# EAGLE design modbus_rtu_io (EAGLE 6.4)
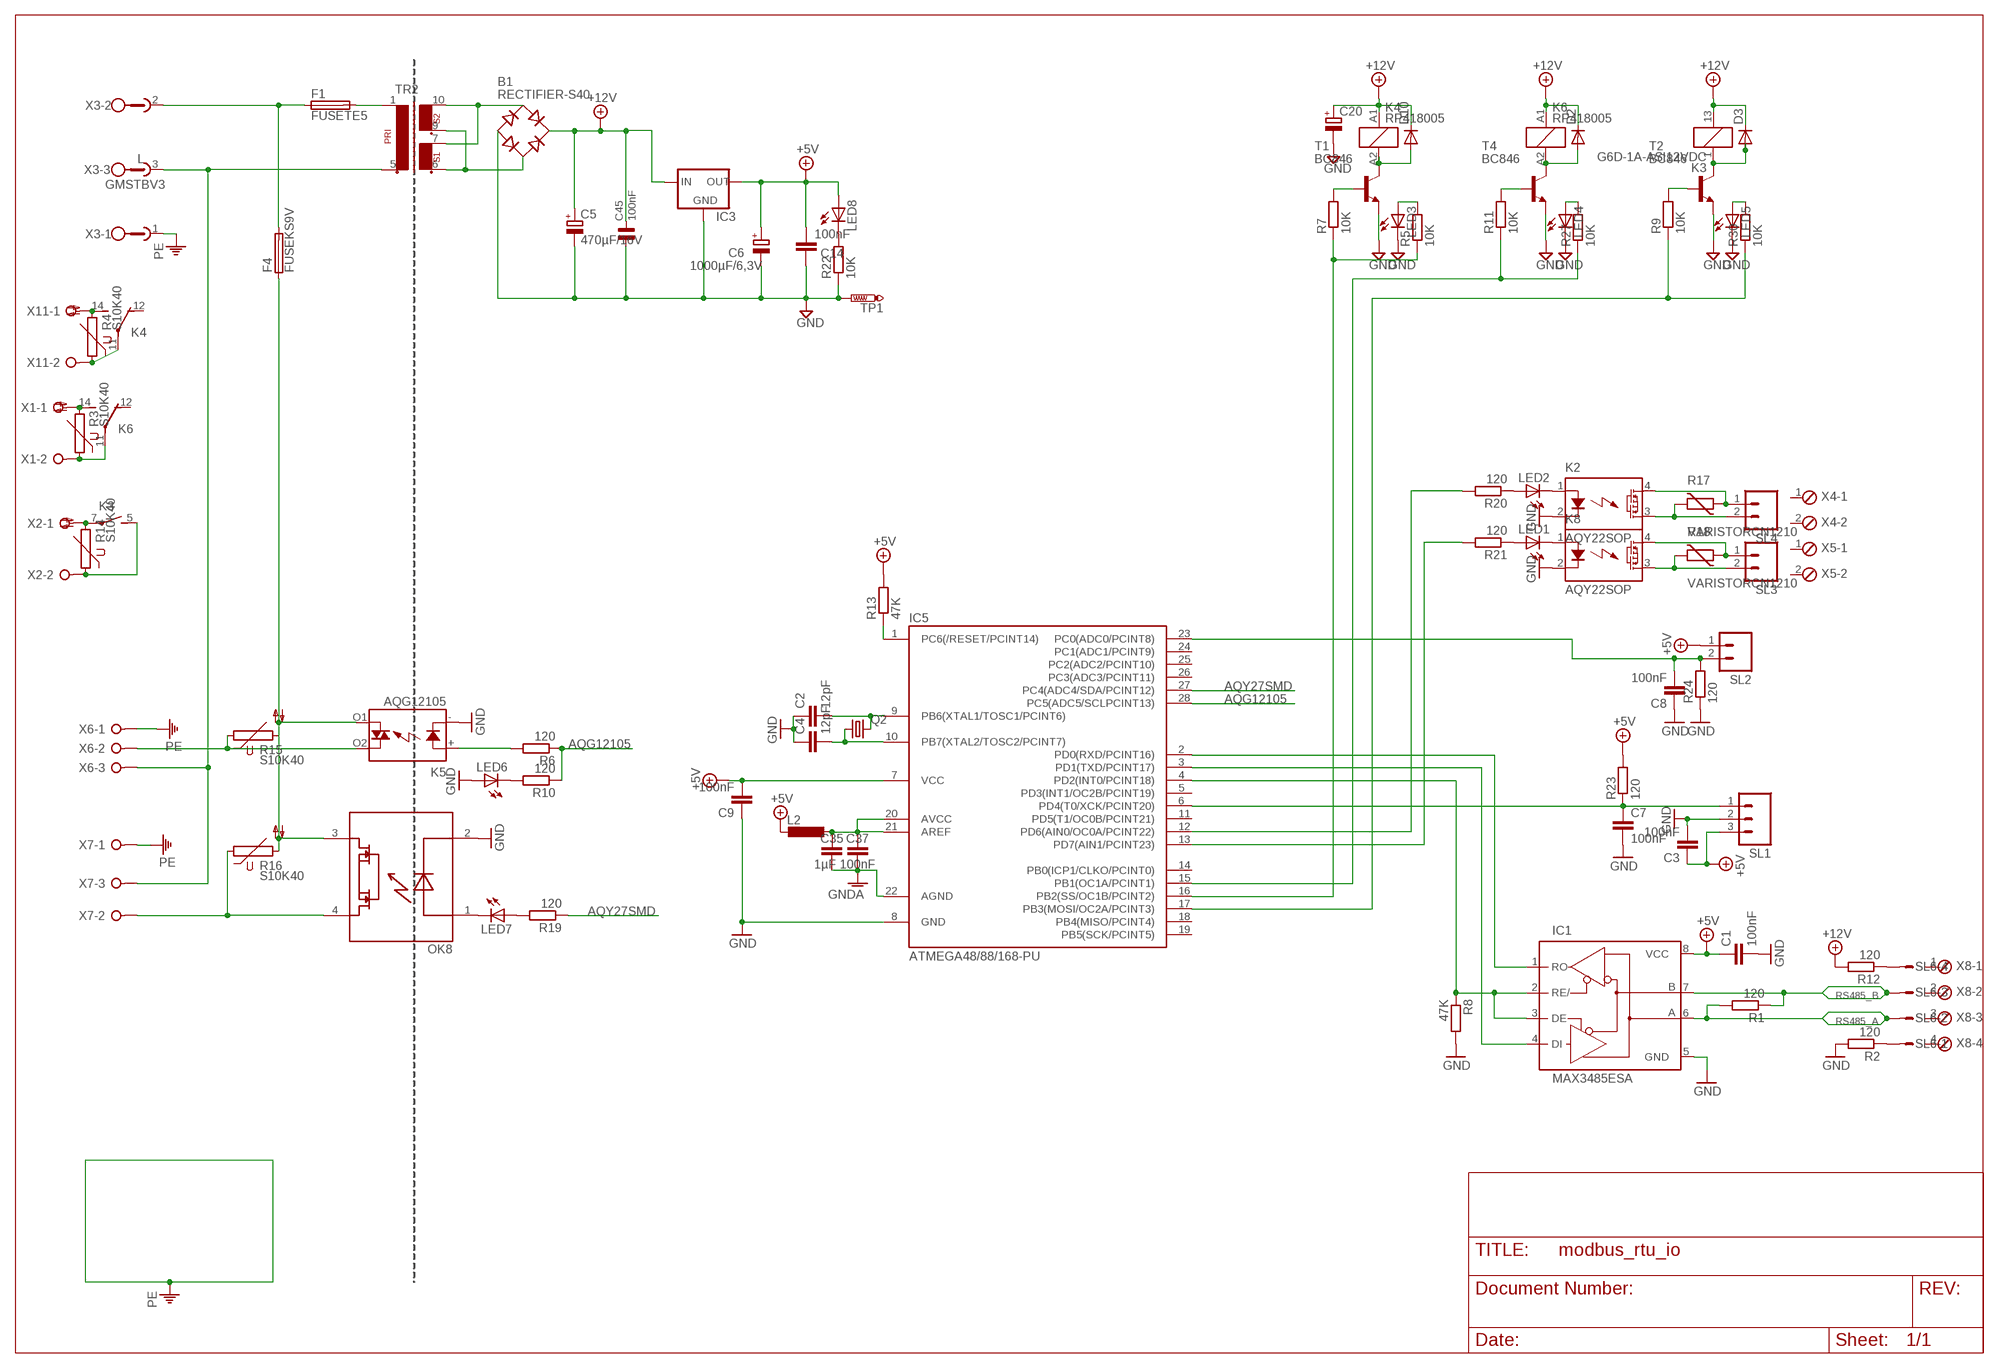
[diagram p0: schematic, sheet 1]

## Parts
B1  RECTIFIER-S40  [TO-269AA]
C1  100nF  C-EUC0603  [C0603]
C2  12pF  C-EUC0805  [C0805]
C3  100nF  C-EUC0603  [C0603]
C4  12pF  C-EUC0805  [C0805]
C5  470µF/16V  CPOL-EUE3.5-8  [E3,5-8]
C6  1000µF/6,3V  CPOL-EUE3.5-8  [E3,5-8]
C7  100nF  C-EUC0603  [C0603]
C8  100nF  C-EUC0603  [C0603]
C9  100nF  C-EUC0603  [C0603]
C14  100nF  C-EUC1206  [C1206]
C20  CPOL-EUE3.5-8  [E3,5-8]
C35  1µF  C-EUC0603  [C0603]
C37  100nF  C-EUC0603  [C0603]
C45  100nF  C0805  [C0805]
D2  DIODE-MINIMELF  [MINIMELF]
D3  DIODE-MINIMELF  [MINIMELF]
D10  DIODE-MINIMELF  [MINIMELF]
F1  FUSETE5  [TE5]
F4  FUSEKS9V  [KS9V]
IC1  MAX3485ESA  MAX3469ESA  [SO08]
IC3  78XXS  [78XXS]
IC5  ATMEGA48/88/168-PU  [DIL28-3]
K2  AQY22SOP  [SOP04]
K3  G6D-1A-ASI12VDC  [G6D]
K4  RP418005  [RT-C/O12A3.5]
K5  AQG12105  [AQG]
K6  RP418005  [RT-C/O12A3.5]
K8  AQY22SOP  [SOP04]
L2  L-EUL0805  [L0805]
LED1  LED3MM  [LED3MM]
LED2  LED3MM  [LED3MM]
LED3  LED3MM  [LED3MM]
LED4  LED3MM  [LED3MM]
LED5  LED3MM  [LED3MM]
LED6  LED3MM  [LED3MM]
LED7  LED3MM  [LED3MM]
LED8  LED3MM  [LED3MM]
OK8  AQY280  [DIL4-SMD]
Q2  CRYTALHC49S  [HC49/S]
R1  120  R-EU_R0603  [R0603]
R2  120  R-EU_R0603  [R0603]
R3  S10K40  [S10K40]
R4  S10K40  [S10K40]
R5  10K  R-EU_R0603  [R0603]
R6  120  R-EU_R0603  [R0603]
R7  10K  R-EU_R0603  [R0603]
R8  47K  R-EU_R0603  [R0603]
R9  10K  R-EU_R0603  [R0603]
R10  120  R-EU_R0603  [R0603]
R11  10K  R-EU_R0603  [R0603]
R12  120  R-EU_R0603  [R0603]
R13  47K  R-EU_R0603  [R0603]
R14  S10K40  [S10K40]
R15  S10K40  [S10K40]
R16  S10K40  [S10K40]
R17  VARISTORCN1210  [CT/CN1210]
R18  VARISTORCN1210  [CT/CN1210]
R19  120  R-EU_R0603  [R0603]
R20  120  R-EU_R0603  [R0603]
R21  120  R-EU_R0603  [R0603]
R22  10K  R-EU_R0603  [R0603]
R23  120  R-EU_R0603  [R0603]
R24  120  R-EU_R0603  [R0603]
R27  10K  R-EU_R0603  [R0603]
R30  10K  R-EU_R0603  [R0603]
SL1  M03  [03P]
SL2  M02  [02P]
SL3  M02  [02P]
SL4  M02  [02P]
SL6  M04S  [04P]
T1  BC846  [SOT23]
T2  BC846  [SOT23]
T4  BC846  [SOT23]
TP1  PTR1PAD1-13  [P1-13]
TR2  EI30-2  [EI30-2]
X1  W237-02P  [W237-132]
X2  W237-02P  [W237-132]
X3  GMSTBV3  [GMSTBV3]
X4  MPT2  [2POL254]
X5  MPT2  [2POL254]
X6  W237-03P  [W237-133]
X7  W237-03P  [W237-133]
X8  MPT4  [4POL254]
X11  W237-02P  [W237-132]

## Nets
+5V: C1.1 C3.1 C6.+ C9.2 C14.2 IC1.8(VCC) IC3.OUT IC5.7(VCC) L2.2 LED8.A R13.2 R23.2 SL1.3 SL2.1
+12V: B1.+ C5.+ C20.+ C45.2 D2.C D3.C D10.C IC3.IN K3.13 K4.A1 K6.A1 R12.2
AQG12105: IC5.28(PC5(ADC5/SCLPCINT13)) R6.1 R10.1
AQY27SMD: IC5.27(PC4(ADC4/SDA/PCINT12)) R19.1
AVCC: C35.1 C37.1 IC5.20(AVCC) IC5.21(AREF) L2.1
GND: B1.- C1.2 C2.1 C3.2 C4.1 C5.- C6.- C7.2 C8.1 C9.1 C14.1 C20.- C45.1 IC1.5(GND) IC3.GND IC5.8(GND) K2.2(K) K5.-(K) K8.2(K) LED3.K(C) LED4.K(C) LED5.K(C) LED6.A OK8.2 R2.2 R8.2 R22.1 R24.1 SL1.2 T1.2(E) T2.2(E) T4.2(E) TP1.TP
GNDA: C35.2 C37.2 IC5.22(AGND)
L: F1.1 F4.2 X3.2
N$1: C2.2 IC5.9(PB6(XTAL1/TOSC1/PCINT6)) Q2.2
N$2: R9.2 T2.1(B)
N$3: LED3.A R5.2
N$4: K4.11(2:P) R4.1 X11.2
N$5: K4.14(2:S) R4.2 X11.1
N$6: K6.14(2:S) R3.2 X1.1
N$7: R7.2 T1.1(B)
N$8: R2.1 SL6.1
N$9: IC1.1(RO) IC5.2(PD0(RXD/PCINT16))
N$10: IC1.4(DI) IC5.3(PD1(TXD/PCINT17))
N$11: D10.A K4.A2 T1.3(C)
N$12: D3.A K3.1 T2.3(C)
N$13: R11.2 T4.1(B)
N$14: D2.A K6.A2 T4.3(C)
N$15: IC1.2(RE/) IC1.3(DE) IC5.4(PD2(INT0/PCINT18)) R8.1
N$16: K8.4(DS1) R18.1 SL3.1
N$17: C4.2 IC5.10(PB7(XTAL2/TOSC2/PCINT7)) Q2.1
N$18: K8.3(DS2) R18.2 SL3.2
N$19: B1.AC1 TR2.7 TR2.10
N$20: K2.4(DS1) R17.1 SL4.1
N$21: K2.3(DS2) R17.2 SL4.2
N$22: B1.AC2 TR2.6 TR2.9
N$23: F1.2 TR2.1
N$24: K6.11(2:P) R3.1 X1.2
N$25: K3.7(2:P) R14.2 X2.1
N$26: K3.5(2:S) R14.1 X2.2
N$27: K5.O2(DS1) R15.1 X6.2
N$28: TR2.5 X3.3 X6.3 X7.3
N$29: OK8.4 R16.1 X7.2
N$30: K5.+(A) R6.2
N$31: LED7.K(C) OK8.1
N$32: K2.1(A) LED2.K(C)
N$33: F4.1 K5.O1(DS2) OK8.3 R15.2 R16.2
N$34: LED4.A R27.2
N$35: K8.1(A) LED1.K(C)
N$36: IC5.16(PB2(SS/OC1B/PCINT2)) R5.1 R7.1
N$37: IC5.12(PD6(AIN0/OC0A/PCINT22)) R20.2
N$38: IC5.13(PD7(AIN1/PCINT23)) R21.2
N$39: IC5.15(PB1(OC1A/PCINT1)) R11.1 R27.1
N$40: IC5.17(PB3(MOSI/OC2A/PCINT3)) R9.1 R30.1
N$41: LED1.A R21.1
N$42: LED2.A R20.1
N$43: LED7.A R19.2
N$44: LED6.K(C) R10.2
N$45: R12.1 SL6.4
N$50: LED5.A R30.2
N$51: LED8.K(C) R22.2
N$53: C7.1 IC5.6(PD4(T0/XCK/PCINT20)) R23.1 SL1.1
N$55: IC5.1(PC6(/RESET/PCINT14)) R13.1
N$56: C8.2 IC5.23(PC0(ADC0/PCINT8)) R24.2 SL2.2
PE: X3.1 X6.1 X7.1
RS485_A: IC1.6(A) R1.2 SL6.2
RS485_B: IC1.7(B) R1.1 SL6.3
Unconnected: IC5.5(PD3(INT1/OC2B/PCINT19)) IC5.11(PD5(T1/OC0B/PCINT21)) IC5.14(PB0(ICP1/CLKO/PCINT0)) IC5.18(PB4(MISO/PCINT4)) IC5.19(PB5(SCK/PCINT5)) IC5.24(PC1(ADC1/PCINT9)) IC5.25(PC2(ADC2/PCINT10)) IC5.26(PC3(ADC3/PCINT11)) K4.12(2:O) K6.12(2:O) X4.1 X4.2 X5.1 X5.2 X8.1 X8.2 X8.3 X8.4

## Library data of the parts
B1 = rectifier:RECTIFIER-: Rectifier
C1-C4 C7-C9 C14 = rcl:C-EU: CAPACITOR, European symbol
C5 C6 C20 = rcl:CPOL-EU: POLARIZED CAPACITOR, European symbol
C35 C37 = rcl-2:C-EU: CAPACITOR, European symbol
C45 = SMD-Sort2:C0805
D2 D3 D10 = diode-1:DIODE-: DIODE
F1 F4 = fuse:FUSE: Fuse
IC1 = maxim:MAX34*: +5V, Fail-Safe, 40Mbps, Profibus RS-485/RS-422 Transceivers Source: MAX3465-MAX3469.pdf
IC3 = v-reg:78XXS: VOLTAGE REGULATOR
IC5 = atmega8:ATMEGA48/88/168-PU
K2 K8 = relay:AQY*: PhotoMOS Relay NAiS Source: http://www.panasonic-electric-works.com/catalogues/downloads/photomos/ds_x615_en_aqz10_20.pdf; OC_FARNELL: unknown; OC_NEWARK: unknown
K3 = relay:G6D?*: OMRON Slim, Miniature PCB Relay 17.5 × 6.5 × 12.5 mm with Socked Source: http://ecb.omron.com.sg/pdf/relay/power/G6D.pdf; OC_FARNELL: unknown; OC_NEWARK: unknown
K4 K6 = relay:RP?18*: Power PCB Relay RP II/1 SCHRACK 1 pole 8 / 12 A Source: http://www.schrack.com/.. 5834.pdf; OC_FARNELL: unknown; OC_NEWARK: unknown
K5 = relay:AQG*: SOLID STATE RELAY NAiS Zero-cross, Non zero-cross Source: http://www.mew-europe.com/.. en_ds_61611_0000.pdf; MF: AROMAT/ MATSUSHITA; MPN: AQG12105; OC_FARNELL: unknown; OC_NEWARK: 20J4759
L2 = rcl:L-EU: INDUCTOR, European symbol
LED1-LED8 = led:LED: LED OSRAM: - CHIPLED LG R971, LG N971, LY N971, LG Q971, LY Q971, LO R971, LY R971 LH N974, LH R974 LS Q976, LO Q976, LY Q976 LO Q996 - Hyper CHIPLED LW Q18S LB Q993, LB Q99A, LB R99A - SideLED LS A670, LO A670, LY A670, LG A670, LP A670 LB A673, LV A673, LT A673, LW A673 LH A674 LY A675 LS A676, LA A676, LO A676, LY A676, LW A676 LS A679, LY A679, LG A679 - Hyper Micro SIDELED® LS Y876, LA Y876, LO Y876, LY Y876 LT Y87S - SmartLED LW L88C, LW L88S LB L89C, LB L89S, LG L890 LS L89K, LO L89K, LY L89K LS L896, LA L896, LO L896, LY L896 - TOPLED LS T670, LO T670, LY T670, LG T670, LP T670 LSG T670, LSP T670, LSY T670, LOP T670, LYG T670 LG T671, LOG T671, LSG T671 LB T673, LV T673, LT T673, LW T673 LH T674 LS T676, LA T676, LO T676, LY T676, LB T676, LH T676, LSB T676, LW T676 LB T67C, LV T67C, LT T67C, LS T67K, LO T67K, LY T67K, LW E67C LS E67B, LA E67B, LO E67B, LY E67B, LB E67C, LV E67C, LT E67C LW T67C LS T679, LY T679, LG T679 LS T770, LO T770, LY T770, LG T770, LP T770 LB T773, LV T773, LT T773, LW T773 LH T774 LS E675, LA E675, LY E675, LS T675 LS T776, LA T776, LO T776, LY T776, LB T776 LHGB T686 LT T68C, LB T68C - Hyper Mini TOPLED® LB M676 - Mini TOPLED Santana® LG M470 LS M47K, LO M47K, LY M47K Source: http://www.osram.convergy.de LUXEON: - LUMILED® LXK2-PW12-R00, LXK2-PW12-S00, LXK2-PW14-U00, LXK2-PW14-V00 LXK2-PM12-R00, LXK2-PM12-S00, LXK2-PM14-U00 LXK2-PE12-Q00, LXK2-PE12-R00, LXK2-PE12-S00, LXK2-PE14-T00, LXK2-PE14-U00 LXK2-PB12-K00, LXK2-PB12-L00, LXK2-PB12-M00, LXK2-PB14-N00, LXK2-PB14-P00, LXK2-PB14-Q00 LXK2-PR12-L00, LXK2-PR12-M00, LXK2-PR14-Q00, LXK2-PR14-R00 LXK2-PD12-Q00, LXK2-PD12-R00, LXK2-PD12-S00 LXK2-PH12-R00, LXK2-PH12-S00 LXK2-PL12-P00, LXK2-PL12-Q00, LXK2-PL12-R00 Source: www.luxeon.com KINGBRIGHT: KA-3528ASYC Source: www.kingbright.com
OK8 = optocoupler:AQY280
Q2 = crystal:CRYTAL: CRYSTAL
R1 R2 R5-R13 R19-R24 R27 R30 = rcl:R-EU_: RESISTOR, European symbol
R3 R4 R14-R16 = varistor:S10K40: VARISTOR
R17 R18 = varistor:VARISTOR: VARISTOR
SL1 = con-amp-quick:M03: AMP QUICK CONNECTOR; OC_FARNELL: unknown; OC_NEWARK: unknown
SL2-SL4 = con-amp-quick:M02: AMP QUICK CONNECTOR; OC_FARNELL: unknown; OC_NEWARK: unknown
SL6 = con-amp-quick:M04S: AMP QUICK CONNECTOR; OC_FARNELL: unknown; OC_NEWARK: unknown
T1 T2 T4 = transistor:BC846: NPN TRANSISTOR
TP1 = testpad:PTR1: TEST PIN
TR2 = trafo:EI30-2: TRANSFORMER 1 primary winding, 2 secondary windings ERA
X1 X2 X11 = con-wago-508:W237-02P: WAGO SREW CLAMP; OC_FARNELL: unknown; OC_NEWARK: unknown
X3 = con-phoenix-762:GMSTBV3: PHOENIX; MPN: GMSTBVA2,5/3-G-7,62; OC_FARNELL: 1793080; OC_NEWARK: 69R9521
X4 X5 = con-phoenix-254:MPT2: PHOENIX CONNECTOR; OC_FARNELL: unknown; OC_NEWARK: unknown
X6 X7 = con-wago-508:W237-03P: WAGO SREW CLAMP; OC_FARNELL: unknown; OC_NEWARK: unknown
X8 = con-phoenix-254:MPT4: PHOENIX CONNECTOR; OC_FARNELL: unknown; OC_NEWARK: unknown

## Board
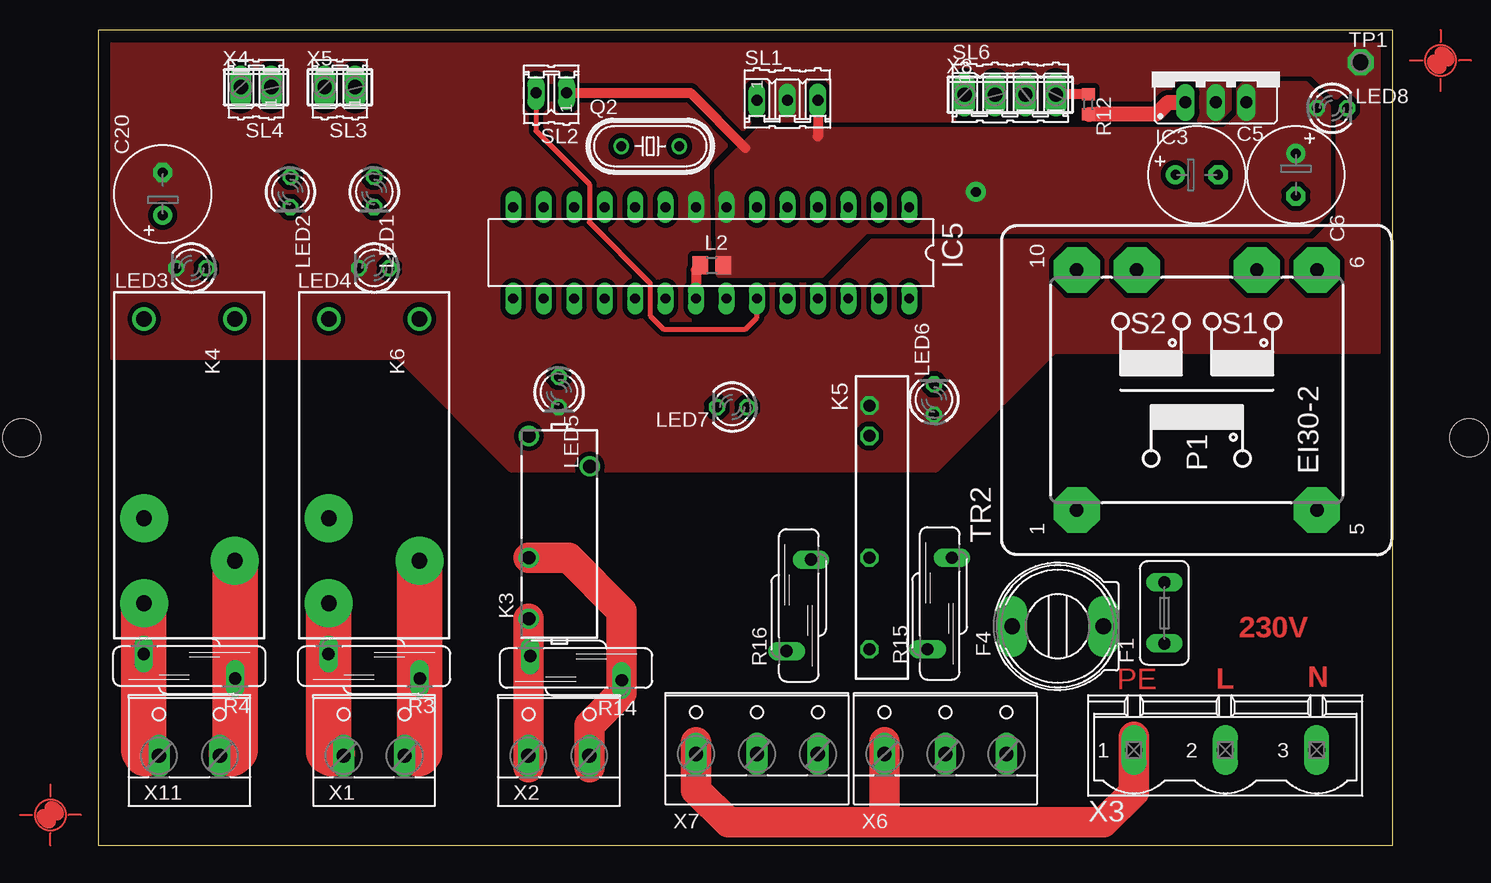
[diagram p1: board, top side]
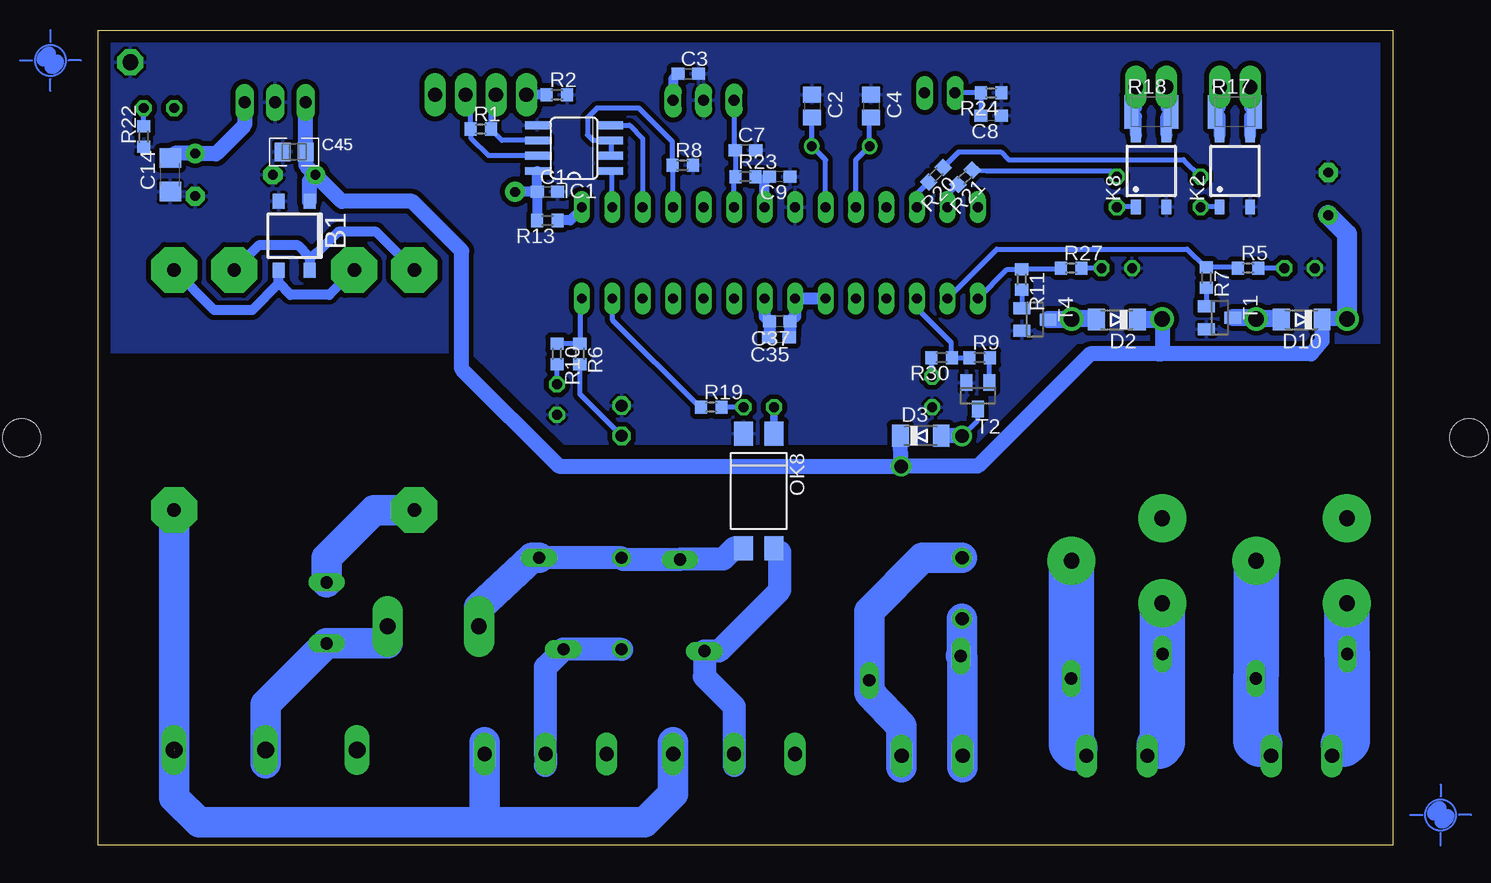
[diagram p2: board, bottom side, seen from below]

Size 107.95 x 67.94 mm. Coordinates in mm from the lower left corner, seen from the top.
Outline: 0,0 107.95,0 107.95,67.94 0,67.94 0,0
Copper layers (1*16): Top 0.035mm / dielectric 1.5mm / Bottom 0.035mm
Design rules "default": minimum track width 10mil, minimum drill 24mil, track to track 8mil, track to pad 8mil, pad to pad 8mil, via to via 8mil, smd to smd 8mil, copper to edge 40mil, drill to drill 8mil, minimum pad ring 10mil, minimum via ring 8mil, stop-mask expansion 4mil, vias tented up to drill 0mil, thermal gap 10mil
Holes 3.17 mm at -6.35,33.97 114.3,33.97
Milling: area 0,0 to 108,67.9

### Footprints (pad centres in the part's own frame; a part is rotated, then mirrored left to right if it is on the bottom)
TO-269AA = smd 1 x 1.25: + -1.28,-2.855; - 1.28,-2.855; AC1 -1.28,2.855; AC2 1.28,2.855
C0603 = smd 1.1 x 1: 1 -0.85,0; 2 0.85,0
C0805 = smd 1.3 x 1.5: 1 -0.95,0; 2 0.95,0
E3,5-8 = drill 0.813 pad 1.6: + -1.778,0 | drill 0.813 pad 1.6 octagon: - 1.778,0
C1206 = smd 1.6 x 1.8: 1 -1.4,0; 2 1.4,0
C0805' = smd 1.321 x 1.524: 1 -0.965,0; 2 0.965,0
MINIMELF = smd 1.4 x 1.8: A 1.7,0; C -1.7,0
TE5 = drill 1.016 long: 1 -2.54,0; 2 2.54,0
KS9V = drill 1.321 pad 2.54 long: 1 0,3.81; 2 0,-3.81
SO08 = smd 0.66 x 2.032: 1 -1.905,-3.073; 2 -0.635,-3.073; 3 0.635,-3.073; 4 1.905,-3.073; 5 1.905,3.073; 6 0.635,3.073; 7 -0.635,3.073; 8 -1.905,3.073
78XXS = drill 1.016 long: GND 0,-2.54; IN -2.54,-2.54; OUT 2.54,-2.54
DIL28-3 = drill 0.813 long: 1 -16.51,-3.81; 2 -13.97,-3.81; 3 -11.43,-3.81; 4 -8.89,-3.81; 5 -6.35,-3.81; 6 -3.81,-3.81; 7 -1.27,-3.81; 8 1.27,-3.81; 9 3.81,-3.81; 10 6.35,-3.81; 11 8.89,-3.81; 12 11.43,-3.81; 13 13.97,-3.81; 14 16.51,-3.81; 15 16.51,3.81; 16 13.97,3.81; 17 11.43,3.81; 18 8.89,3.81; 19 6.35,3.81; 20 3.81,3.81; 21 1.27,3.81; 22 -1.27,3.81; 23 -3.81,3.81; 24 -6.35,3.81; 25 -8.89,3.81; 26 -11.43,3.81; 27 -13.97,3.81; 28 -16.51,3.81
SOP04 = smd 0.8 x 1.2: 1 -1.27,-3; 2 1.27,-3; 3 1.27,3; 4 -1.27,3
G6D = drill 1.1 pad 1.676: 1 8.08,2.5; 5 -2.08,2.5; 7 -7.16,2.5; 13 5.54,-2.58
RT-C/O12A3.5 = drill 1.3 pad 4: 11 7.56,3.78; 12 4.02,-3.78; 14 11.1,-3.78 | drill 1.3: A1 -12.6,-3.78; A2 -12.6,3.78
AQG = drill 1 octagon: + -7.62,0; - -10.16,0; O1 2.54,0; O2 10.16,0
L0805 = smd 1.3 x 1.5: 1 -0.95,0; 2 0.95,0
LED3MM = drill 0.813 octagon: A -1.27,0; K 1.27,0
DIL4-SMD = smd 1.6 x 2: 1 -1.27,-4.77; 2 1.27,-4.77; 3 1.27,4.77; 4 -1.27,4.77
HC49/S = drill 0.813: 1 -2.413,0; 2 2.413,0
R0603 = smd 1 x 1.1: 1 -0.85,0; 2 0.85,0
S10K40 = drill 1.016 long: 1 -1.016,-3.81; 2 1.016,3.81
CT/CN1210 = smd 1.2 x 2.8: 1 -1.65,0; 2 1.65,0
03P = drill 0.914 long: 1 -2.54,0; 2 0,0; 3 2.54,0
02P = drill 0.914 long: 1 -1.27,0; 2 1.27,0
04P = drill 0.914 long: 1 -3.81,0; 2 -1.27,0; 3 1.27,0; 4 3.81,0
SOT23 = smd 1 x 1.4: 1 -0.95,-1.1; 2 0.95,-1.1; 3 0,1.1
P1-13 = drill 1.321 pad 2.159 octagon: TP 0,0
EI30-2 = drill 1.118 pad 3.81 octagon: 1 -10.008,10.008; 5 -10.008,-10.008; 6 10.008,-10.008; 7 10.008,-5.004; 9 10.008,5.004; 10 10.008,10.008
W237-132 = drill 1.194 long: 1 -2.54,-0.635; 2 2.54,-0.635
GMSTBV3 = drill 1.397 long: 1 -7.62,0; 2 0,0; 3 7.62,0
2POL254 = drill 1.2 long: 1 -1.27,0; 2 1.27,0
W237-133 = drill 1.194 long: 1 -5.08,-0.635; 2 0,-0.635; 3 5.08,-0.635
4POL254 = drill 1.2 long: 1 -3.81,0; 2 -1.27,0; 3 1.27,0; 4 3.81,0

### Placement (x,y rotation side)
B1  91.6,50.8 180 bottom
C1  70.48,54.45 0 bottom
C2  48.42,61.59 270 bottom
C3  58.74,64.29 0 bottom
C4  43.5,61.59 270 bottom
C5  91.6,55.88 0 top
C6  99.85,55.88 270 top
C7  53.98,57.94 0 bottom
C8  33.5,60.8 180 bottom
C9  51.12,55.72 180 bottom
C14  101.92,55.88 90 bottom
C20  5.4,54.29 90 top
C35  51.18,42.32 180 bottom
C37  51.12,43.66 180 bottom
C45  100nF  [C0805']  91.6,57.78 0 bottom
D2  23.02,43.82 180 bottom
D3  39.37,34.13 0 bottom
D10  7.62,43.81 180 bottom
F1  88.9,19.37 90 top
F4  80.01,18.26 90 top
IC1  68.26,58.1 90 bottom
IC3  93.19,64.45 0 top
IC5  51.12,49.37 180 top
K2  13.18,56.2 0 bottom
K3  38.42,26.04 90 top
K4  7.62,31.27 270 top
K5  64.3,26.49 270 top
K6  23.02,31.27 270 top
K8  20.16,56.2 0 bottom
L2  51.16,48.35 0 top
LED1  23.02,54.45 270 top
LED2  16.03,54.45 270 top
LED3  7.78,48.1 180 top
LED4  23.02,48.1 180 top
LED5  38.42,37.78 270 top
LED6  69.69,37.15 90 top
LED7  52.86,36.51 180 top
LED8  102.87,61.44 0 top
OK8  52.86,29.53 180 bottom
Q2  46.04,58.26 0 top
R1  76.04,59.69 0 bottom
R2  69.69,62.55 0 bottom
R3  23.02,14.92 90 top
R4  7.62,14.92 90 top
R5  12.06,48.1 0 bottom
R6  67.79,40.96 270 bottom
R7  15.56,47.31 270 bottom
R8  59.21,56.67 0 bottom
R9  34.45,40.64 0 bottom
R10  69.69,40.96 270 bottom
R11  30.96,47.15 270 bottom
R12  82.55,61.75 270 top
R13  70.48,52.07 180 bottom
R14  39.85,14.76 90 top
R15  70.17,20.16 0 top
R16  58.42,20 0 top
R17  13.18,61.12 0 bottom
R18  20.16,61.12 0 bottom
R19  56.83,36.51 0 bottom
R20  38.1,55.88 225 bottom
R21  35.67,55.67 225 bottom
R22  104.14,59.05 90 bottom
R23  53.98,55.72 0 bottom
R24  33.5,62.71 180 bottom
R27  26.83,48.1 0 bottom
R30  37.62,40.64 180 bottom
SL1  57.47,62.07 0 top
SL2  37.78,62.71 180 top
SL3  20.16,63.18 180 top
SL4  13.18,63.18 180 top
SL6  76.04,62.55 0 top
T1  14.45,43.97 270 bottom
T2  34.61,37.46 180 bottom
T4  29.85,43.81 270 bottom
TP1  105.25,65.25 0 top
TR2  91.6,37.94 90 top
U$1  [PASS-ROUND]  111.92,65.41 0 top  (outside the outline)
U$2  [PASS-ROUND]  -3.97,2.54 0 top  (outside the outline)
X1  23.02,8.1 0 top
X2  38.42,8.1 0 top
X3  93.98,7.94 0 top
X4  13.18,63.18 0 top
X5  20.16,63.18 0 top
X6  70.64,8.26 0 top
X7  54.93,8.26 0 top
X8  76.04,62.55 0 top
X11  7.62,8.1 0 top

### Tracks (layer width: path | path; a pad name or v marks a point on that pad's centre or on a via)
+5V  (via drill 0.8 pad 1.68)
  Top 0.813: SL1.3 60.01,59.05 | SL2.1 49.37,62.71 53.98,58.1
  Bottom 0.406: R23.2 C9.2
  Bottom 0.813: IC5.7 52.39,55.3 C9.2 | C1.1 v73.18,54.45 | C1.1 IC1.8 | C1.1 R13.2 | C3.1 60.01,63.87 SL1.3
  Bottom 1.27: IC3.OUT 95.73,60.01 98.11,57.63 99.82,57.63 C6.+ 101.54,57.66 C14.2
  pour Top (isolate 0.406, no thermals): 102.55,61.59 102.55,52.86 100.81,51.12 63.98,51.12 60.33,47.47 51.75,47.47 51.59,56.2 55.09,59.69 93.98,59.69 95.09,60.8 95.09,63.02 95.57,63.5 100.65,63.5
+12V
  Top 0.813: R12.2 82.61,60.9
  Top 1.27: 82.61,60.9 83.34,60.96 88.27,60.96 89.22,61.91 IC3.IN
  Bottom 1.27: 41.01,31.59 69.53,31.59 77.63,39.69 77.63,49.53 81.76,53.66 87.63,53.66 89.82,55.85 C5.+ | 41.01,31.59 K3.13 40.98,31.59 34.61,31.59 25.24,40.96 19.53,40.96 19.29,41.2 | K6.A1 19.24,41.24 19.29,41.2 | K4.A1 5.86,43.87 D10.C 5.92,42.02 6.83,40.96 19.37,40.96 19.29,41.2 | 41.01,31.59 41.07,34.08 D3.C | C5.+ | B1.+ 90.32,55.38 C5.+ | C5.+ 90.63,56.69 C45.2 90.63,61.9 IC3.IN
  Bottom 1.422: K6.A1 19.3,43.81 D2.C
  Bottom 1.676: C20.+ 3.84,50.96 K4.A1
AQG12105
  Bottom 0.406: IC5.28 67.79,45.4 R6.1 R10.1
AQY27SMD
  Bottom 0.406: IC5.27 65.09,43.81 57.94,36.67 R19.1
AVCC
  Top 0.813: L2.1 50.21,48.31 49.85,47.94 49.9,45.45 IC5.21
  Bottom 1.016: C35.1 50.27,42.39 C37.1 49.85,44.08 IC5.21 IC5.20
GND
  pour Bottom (isolate 0.406, rank 3): 0.48,67.47 107.47,67.47 107.47,41.12 76.83,41.12 69.06,33.5 34.77,33.5 26.35,41.91 0.48,41.91
  pour Top (isolate 0.406, rank 3, no thermals): 0.48,67.47 107.47,67.47 107.47,41.12 79.69,41.12 69.85,31.27 34.45,31.27 25.08,40.64 0.48,40.64
GNDA
  Bottom 1.016: IC5.22 52.39,44.08 C37.2 51.97,42.39 C35.2
L
  Bottom 2.54: F4.2 83.82,18.57 83.82,16.83 F1.1 93.98,11.75 X3.2 | X3.2 | X3.2 93.98,6.83
N$1
  Bottom 0.406: IC5.9 47.31,57.12 Q2.2 48.45,60.61 C2.2
N$2
  Bottom 0.406: T2.1 33.66,40.58 R9.2
N$3
  Bottom 0.406: LED3.A | LED3.A R5.2
N$4
  Bottom 1.422: 11.11,8.41 X11.2
  Bottom 3.81: K4.11 11.4,14.41 R4.1 11.43,8.73 11.11,8.41
N$5
  Bottom 1.422: 4.13,8.41 X11.1
  Bottom 3.81: K4.14 3.84,15.97 R4.2 3.81,8.73 4.13,8.41
N$6
  Bottom 1.422: 19.53,8.26 19.68,8.26 X1.1
  Bottom 3.81: K6.14 19.24,15.97 R3.2 19.21,8.57 19.53,8.26
N$7
  Bottom 0.406: R7.2 15.55,46.45 T1.1
N$8
  Bottom 0.813: R2.1 SL6.1
N$9
  Bottom 0.305: 65.09,56.1 IC1.1
  Bottom 0.406: IC5.2 65.09,56.1
N$10
  Bottom 0.406: IC1.4 63.66,60.01 62.55,58.9 IC5.3
N$11
  Bottom 1.422: D10.A 9.38,43.87 K4.A2 11.5,43.97 T1.3
N$12
  Bottom 0.406: K3.1 34.61,35.42 T2.3
  Bottom 1.27: K3.1 35.93,34.13 D3.A
N$13
  Bottom 0.406: R11.2 30.95,46.29 T4.1
N$14
  Bottom 1.422: D2.A 24.78,43.87 K6.A2 26.86,43.81 T4.3
N$15
  Bottom 0.305: 60.01,56.46 R8.1
  Bottom 0.406: R8.1 60.06,58.63 62.87,61.44 66.36,61.44 67.15,60.64 67.15,59.21 66.67,58.74 IC1.3 IC1.2 | IC5.4 60.01,56.46
N$16
  Bottom 1.016: K8.4 21.43,60.74 R18.1 21.43,61.5 SL3.1
N$17
  Bottom 0.406: IC5.10 44.77,57.12 Q2.1 43.62,60.52 C4.2
N$18
  Bottom 1.016: K8.3 18.89,60.74 R18.2 18.89,61.5 SL3.2
N$19
  Bottom 0.813: TR2.7 94.55,50.01 91.28,50.01 90.25,48.97 | 90.25,48.97 90.32,48.88 B1.AC1 | TR2.10 84.76,51.12 87.95,51.12 89.61,49.45 90.25,48.97
N$20
  Bottom 1.016: K2.4 14.45,60.74 R17.1 14.45,61.5 SL4.1
N$21
  Bottom 1.016: K2.3 11.91,60.74 R17.2 11.91,61.5 SL4.2
N$22
  Bottom 0.813: TR2.6 98.27,44.61 95.09,44.61 92.88,46.82 | 92.88,46.82 B1.AC2 | TR2.9 88.67,45.88 91.92,45.88 92.86,46.82 92.88,46.82
N$23
  Bottom 2.54: TR2.1 84.94,27.93 88.9,23.97 F1.2
N$24
  Bottom 1.422: X1.2 25.88,7.46 26.75,8.33
  Bottom 3.81: K6.11 26.8,14.41 R3.1 26.83,8.41 26.75,8.33 26.51,8.1
N$25
  Top 2.54: 35.88,18.89 X2.1 35.88,6.51
  Bottom 2.54: K3.7 35.92,15.9 R14.2 35.88,15.62 X2.1 35.88,6.51
N$26
  Top 2.54: 35.88,23.97 39.21,23.97 43.66,19.53 43.66,12.7 40.96,10 X2.2 40.96,6.51
  Bottom 2.54: K3.5 39.23,23.95 43.66,19.53 R14.1 43.66,12.7 40.96,9.94 X2.2 40.96,6.51
N$27
  Bottom 1.676: 69.13,16.33 R15.1
  Bottom 1.93: K5.O2 69.13,16.33 | R15.1 70.64,14.86 X6.2 70.64,6.67
N$28  (1 unrouted)
  Bottom 2.54: 75.41,1.91 99.54,1.91 101.6,3.97 X3.3 101.61,15.56 TR2.5 | 75.41,1.91 62.39,1.91 60.01,4.29 X7.3 60.01,8.57 | 75.41,1.91 75.72,2.22 X6.3 75.72,8.57
N$29
  Bottom 0.813: 51.12,24.45 51.44,24.6 OK8.4
  Bottom 1.93: 51.12,24.45 51.12,21.27 56.2,16.19 R16.1 57.4,14.06 54.93,11.59 X7.2 54.93,6.67
N$30
  Bottom 0.406: K5.+ 67.79,37.6 R6.2
N$31
  Bottom 0.61: OK8.1 LED7.K
N$32
  Bottom 0.406: K2.1 16.02,53.2 LED2.K
N$33
  Bottom 0.813: 54.93,24.77 OK8.3
  Bottom 1.676: 59.38,23.87 R16.2
  Bottom 1.93: R16.2 64.16,23.81 K5.O1 71.16,23.95 R15.2 | 59.38,23.87 55.82,23.87 54.93,24.77
  Bottom 2.54: R15.2 71.75,23.97 76.2,19.84 76.2,18.57 F4.1
N$34
  Bottom 0.406: LED4.A | LED4.A R27.2
N$35
  Bottom 0.406: K8.1 23,53.2 LED1.K
N$36
  Bottom 0.406: IC5.16 33.02,49.69 17.14,49.69 15.61,48.16 R7.1 12.97,48.16 R5.1
N$37
  Bottom 0.406: IC5.12 39.69,54.29 R20.2
N$38
  Bottom 0.406: IC5.13 37.15,54.2 R21.2
N$39
  Bottom 0.406: IC5.15 32.17,48 R11.1 27.78,48 R27.1
N$40
  Bottom 0.406: IC5.17 39.69,44.77 36.83,41.91 36.83,40.7 R30.1 R9.1
N$41
  Bottom 0.406: R21.1 33.88,56.2 23.5,56.2 LED1.A
N$42
  Bottom 0.406: R20.1 36.2,57.78 32.7,57.78 32.07,57.15 17.46,57.15 LED2.A
N$43
  Bottom 0.406: LED7.A R19.2
N$44
  Bottom 0.406: LED6.K R10.2
N$45
  Top 0.813: R12.1 79.91,62.6 SL6.4
N$46
  Top 3.81: 3.81,20.16 3.81,7.94 3.97,7.62
N$47
  Top 3.81: 11.43,23.65 11.43,7.94 11.11,7.62
N$48
  Top 3.81: 19.21,20.16 19.21,7.78 19.53,7.62
N$49
  Top 3.81: 26.83,23.65 26.83,7.78 26.67,7.62
N$50
  Bottom 0.406: LED5.A 38.42,40.58 R30.2
N$51
  Bottom 0.406: R22.2 LED8.K
N$53
  Bottom 0.406: SL1.1 54.93,58.05 C7.1 R23.1 54.93,55.62 IC5.6
N$55
  Bottom 0.813: IC5.1 67.63,53.02 68.58,52.07 R13.1
N$56
  Top 0.406: SL2.2 36.51,59.53 40.96,55.09 40.96,51.91 46.04,46.83 46.04,44.13 47.15,43.02 53.98,43.02 54.93,43.97 IC5.23
  Bottom 0.406: SL2.2 R24.2 C8.2
PE
  Top 2.54: 65.72,1.91 83.82,1.91 86.36,4.45 X3.1 86.36,9.05 | 65.72,1.91 52.55,1.91 49.85,4.6 X7.1 49.85,8.57 | 65.72,1.91 65.56,2.06 X6.1 65.56,8.57
RS485_A
  Bottom 0.305: 75.25,59.69 75.25,59.63 R1.2
  Bottom 0.406: R1.2 75.19,60.86 74.77,61.28 SL6.2 | IC1.6 74.3,58.74 75.25,59.69
RS485_B
  Bottom 0.305: 76.83,59.63 R1.1
  Bottom 0.406: R1.1 76.89,61.02 77.31,61.44 SL6.3 | IC1.7 75.41,57.47 76.83,58.9 76.83,59.63

### Text on the board
Top: 230V | PE | L | N